# EAGLE schematic eeprom_emu_bt (EAGLE 7.2.0)
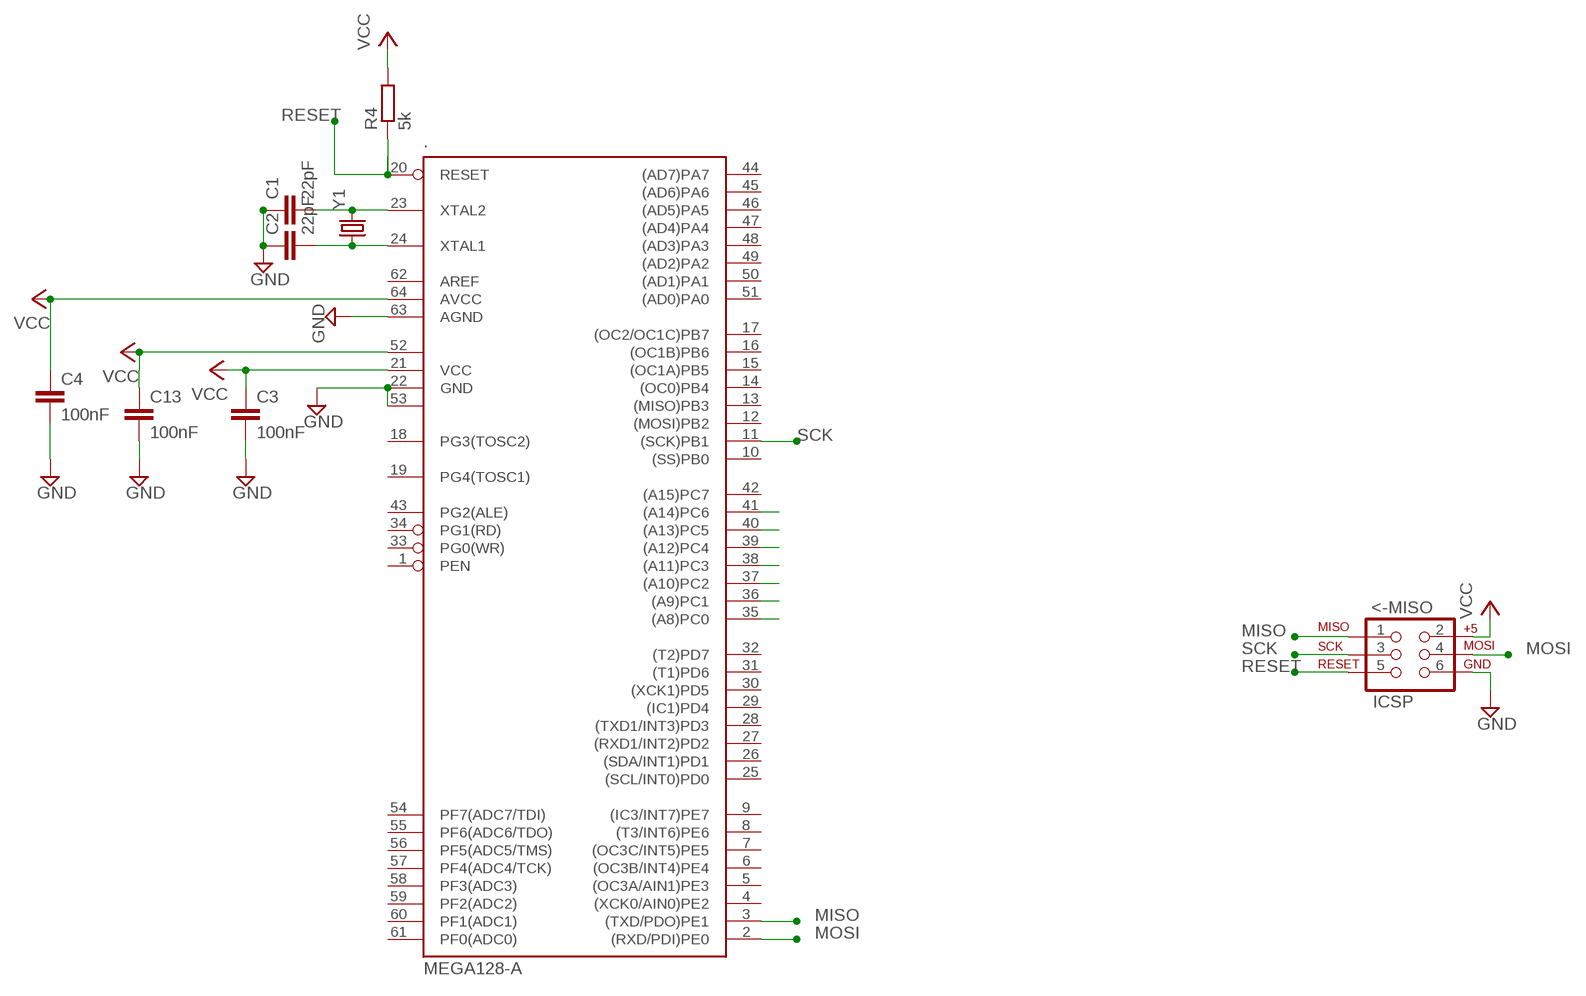
[diagram p0: schematic, sheet 1]

## Parts
.  MEGA128-A  [TQFP64]
<-MISO  ICSP  AVR_SPI_PRG_6PTH  [2X3]
C1  22pF  C-EUC0805  [C0805]
C2  22pF  C-EUC0805  [C0805]
C3  100nF  C-EUC0805  [C0805]
C4  100nF  C-EUC0805  [C0805]
C13  100nF  C-EUC0805  [C0805]
R4  5k  R-EU_R0805  [R0805]
Y1  CRYSTALHC49US  [HC49US]

## Nets
A8: ..35((A8)PC0)
A9: ..36((A9)PC1)
A10: ..37((A10)PC2)
A11: ..38((A11)PC3)
A12: ..39((A12)PC4)
A13: ..40((A13)PC5)
A14: ..41((A14)PC6)
GND: ..22(GND) ..53(GND1) ..63(AGND) <-MISO.6 C1.1 C2.1 C3.2 C4.2 C13.2
MISO: ..3((TXD/PDO)PE1) <-MISO.1
MOSI: ..2((RXD/PDI)PE0) <-MISO.4
N$1: ..24(XTAL1) C2.2 Y1.1
N$2: ..23(XTAL2) C1.2 Y1.2
RESET: ..20(RESET) <-MISO.5 R4.1
SCK: ..11((SCK)PB1) <-MISO.3
VCC: ..21(VCC) ..52(VCC1) ..64(AVCC) <-MISO.2 C3.1 C4.1 C13.1 R4.2
Unconnected: ..1(PEN) ..4((XCK0/AIN0)PE2) ..5((OC3A/AIN1)PE3) ..6((OC3B/INT4)PE4) ..7((OC3C/INT5)PE5) ..8((T3/INT6)PE6) ..9((IC3/INT7)PE7) ..10((SS)PB0) ..12((MOSI)PB2) ..13((MISO)PB3) ..14((OC0)PB4) ..15((OC1A)PB5) ..16((OC1B)PB6) ..17((OC2/OC1C)PB7) ..18(PG3(TOSC2)) ..19(PG4(TOSC1)) ..25((SCL/INT0)PD0) ..26((SDA/INT1)PD1) ..27((RXD1/INT2)PD2) ..28((TXD1/INT3)PD3) ..29((IC1)PD4) ..30((XCK1)PD5) ..31((T1)PD6) ..32((T2)PD7) ..33(PG0(WR)) ..34(PG1(RD)) ..42((A15)PC7) ..43(PG2(ALE)) ..44((AD7)PA7) ..45((AD6)PA6) ..46((AD5)PA5) ..47((AD4)PA4) ..48((AD3)PA3) ..49((AD2)PA2) ..50((AD1)PA1) ..51((AD0)PA0) ..54(PF7(ADC7/TDI)) ..55(PF6(ADC6/TDO)) ..56(PF5(ADC5/TMS)) ..57(PF4(ADC4/TCK)) ..58(PF3(ADC3)) ..59(PF2(ADC2)) ..60(PF1(ADC1)) ..61(PF0(ADC0)) ..62(AREF)

## Library data of the parts
. = avr-7:MEGA128: MICROCONTROLLER 128 Kbytes FLASH 4 Kbytes SRAM 4 Kbytes EEPROM DUAL USART 8-channel 10 bit ADC
<-MISO = SparkFun-Connectors:AVR_SPI_PRG_6: AVR ISP 6 Pin This is the reduced ISP connector for AVR programming. Common on Arduino. This footprint will take up less PCB space and can be used with a 10-pin to 6-pin adapter such as SKU: BOB-08508 **Special note about "TEST_POINT" package. The stop mask is on the top side, so if you want your programming test points to be on the bottom of your board, make sure to place this package on the bottom side of the board. This also ensure that the orientation to program from the bottom side will be correct.
C1-C4 C13 = resistor:C-EU: CAPACITOR, European symbol
R4 = rcl:R-EU_: RESISTOR, European symbol
Y1 = SparkFun-FreqCtrl:CRYSTAL: Various standard crystals. Proven footprints.